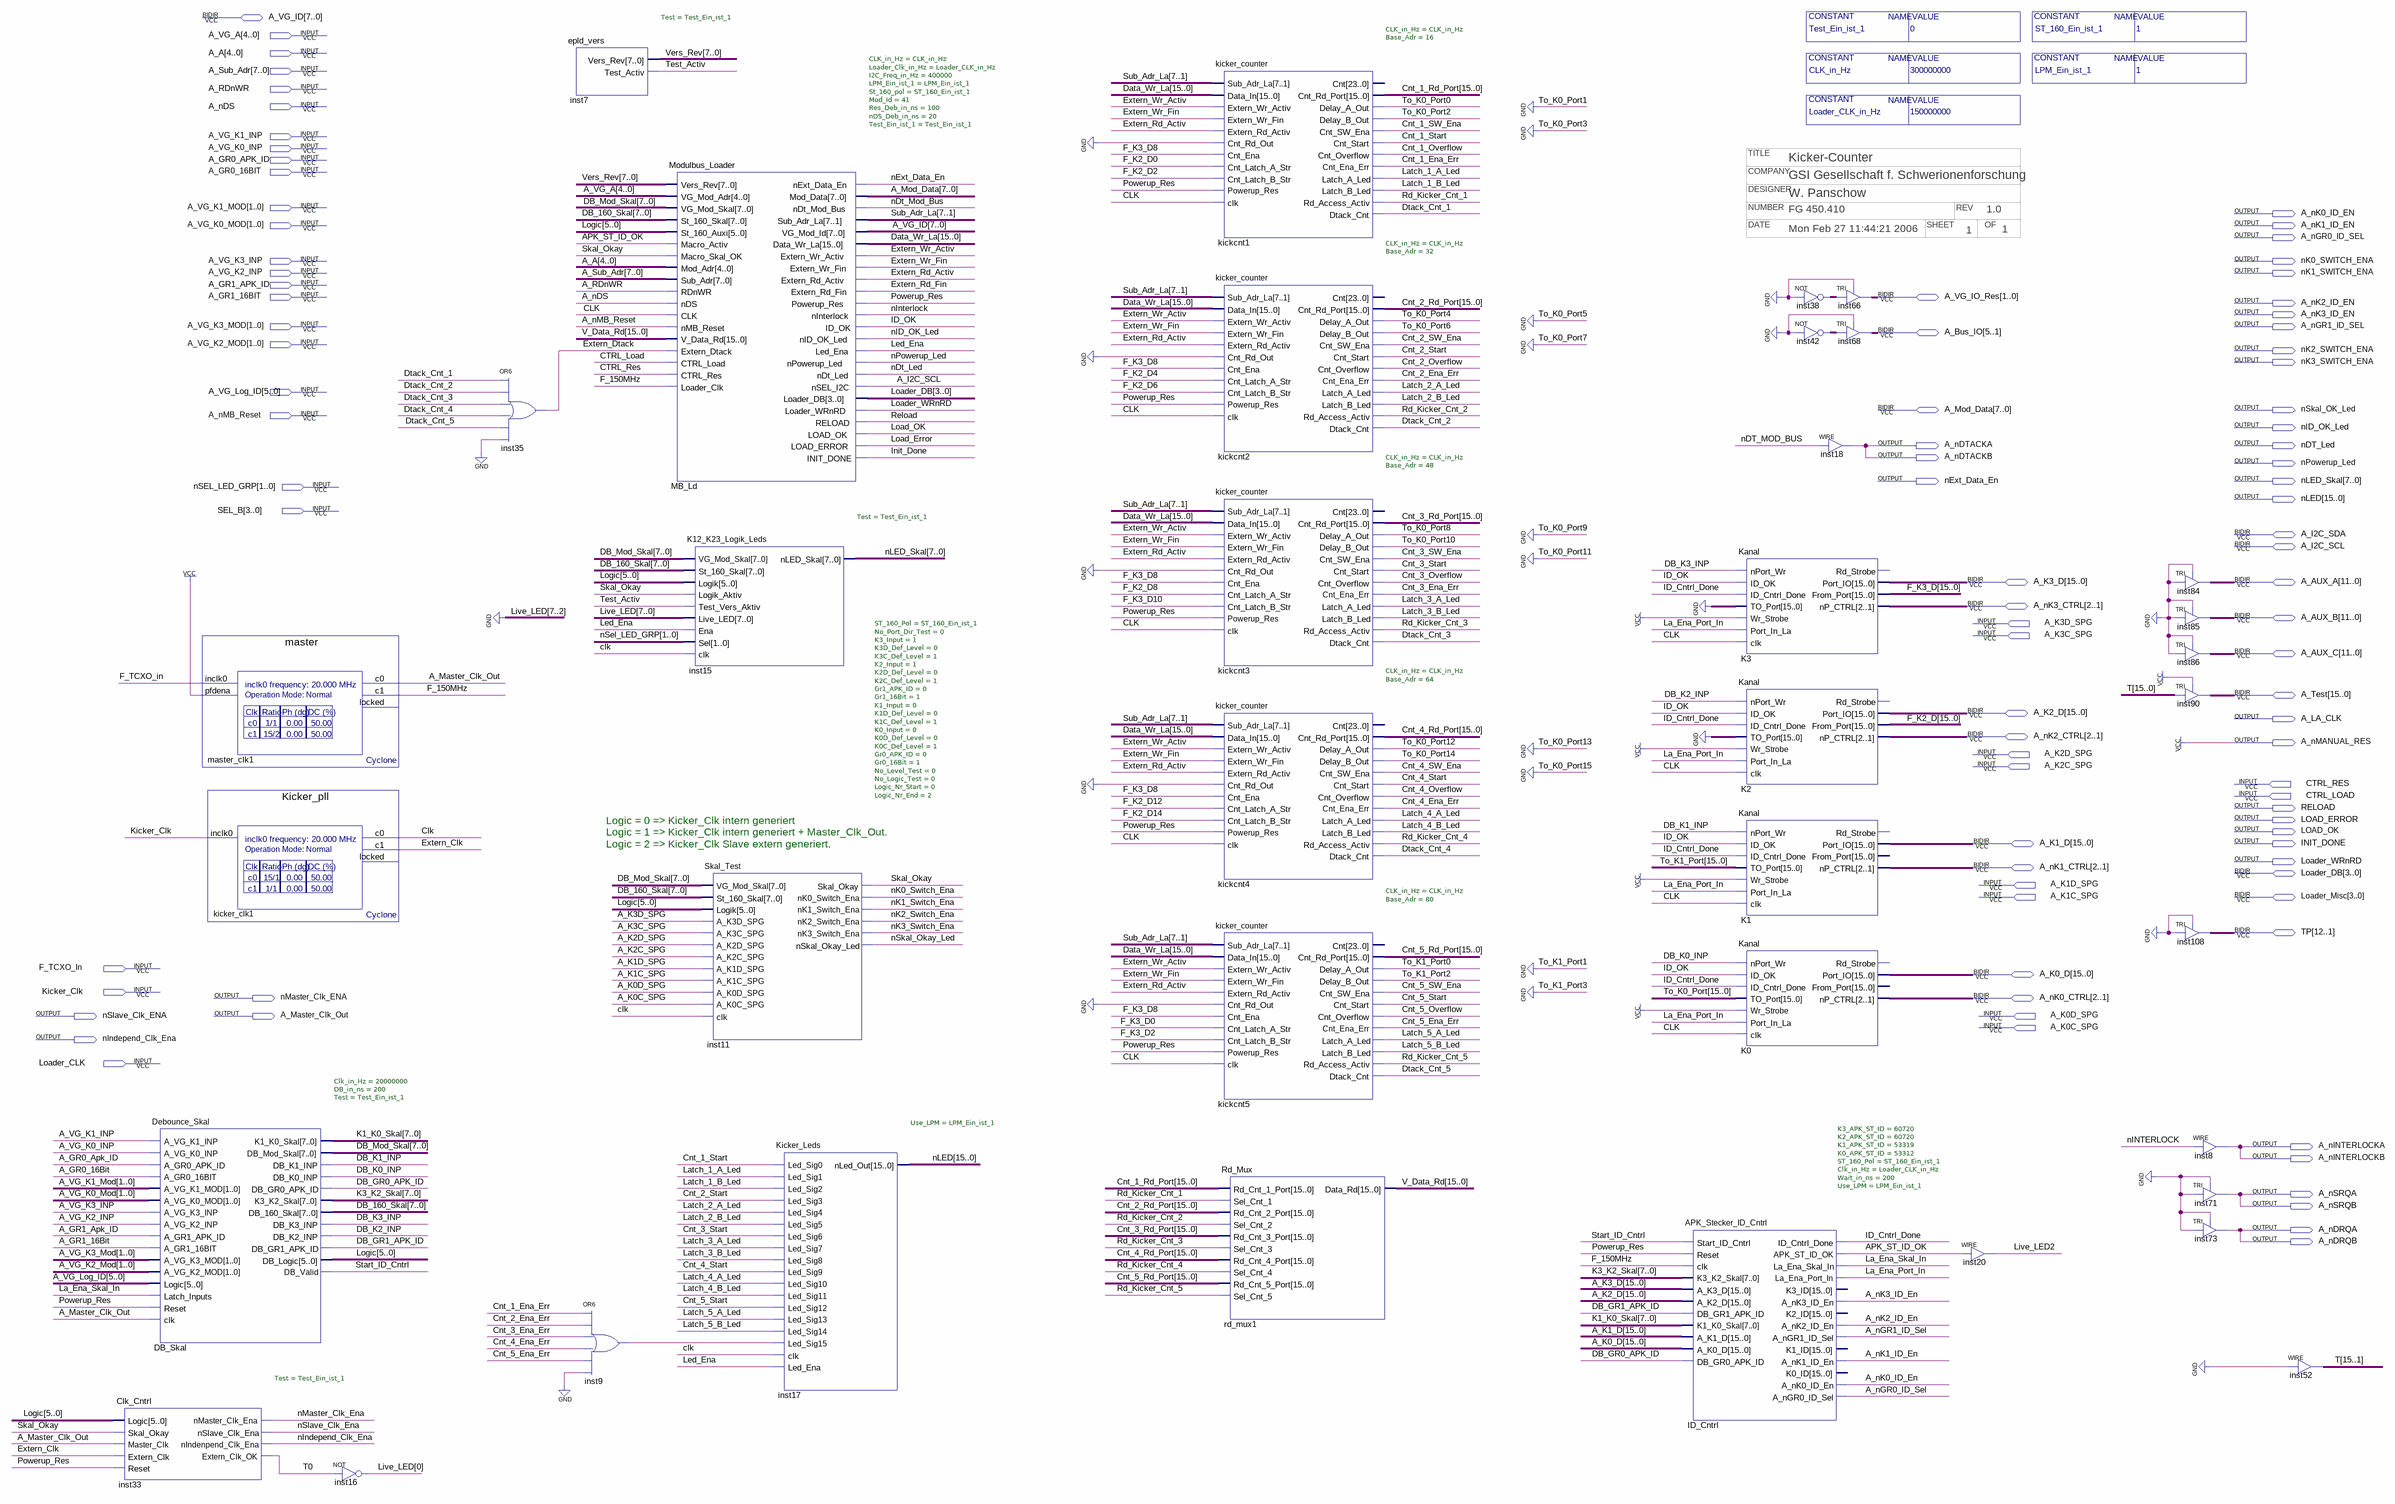
[diagram p0: schematic sheet]
// Quartus schematic Kicker.bdf as structural Verilog: 38 symbols, 91 pins
// Title block: TITLE: Kicker-Counter; COMPANY: GSI Gesellschaft f. Schwerionenforschung; DESIGNER: W. Panschow; NUMBER: FG 450.410; REV: 1.0; DATE: Mon Feb 27 11:44:21 2006; SHEET: 1; OF: 1
module Kicker #(parameter CLK_in_Hz = 300000000, parameter LPM_Ein_ist_1 = 1, parameter ST_160_Ein_ist_1 = 1, parameter Loader_CLK_in_Hz = 150000000, parameter Test_Ein_ist_1 = 0) (
  input  [4:0] A_VG_A,
  input  [4:0] A_A,
  input  [7:0] A_Sub_Adr,
  input  A_RDnWR,
  input  A_nDS,
  input  A_VG_K1_INP,
  input  A_VG_K0_INP,
  input  A_GR0_APK_ID,
  input  A_GR0_16BIT,
  input  [1:0] A_VG_K1_MOD,
  input  [1:0] A_VG_K0_MOD,
  input  A_VG_K3_INP,
  input  A_VG_K2_INP,
  input  A_GR1_APK_ID,
  input  A_GR1_16BIT,
  input  [1:0] A_VG_K3_MOD,
  input  [1:0] A_VG_K2_MOD,
  input  [5:0] A_VG_Log_ID,
  input  A_nMB_Reset,
  input  [1:0] nSEL_LED_GRP,
  input  [3:0] SEL_B,
  input  A_K3D_SPG,
  input  A_K3C_SPG,
  input  A_K2D_SPG,
  input  A_K2C_SPG,
  input  CTRL_RES,
  input  CTRL_LOAD,
  input  A_K1D_SPG,
  input  A_K1C_SPG,
  input  F_TCXO_In,
  input  Kicker_Clk,
  input  A_K0D_SPG,
  input  A_K0C_SPG,
  input  Loader_CLK,
  inout  [7:0] A_VG_ID,
  inout  [1:0] A_VG_IO_Res,
  inout  [5:1] A_Bus_IO,
  inout  [7:0] A_Mod_Data,
  inout  A_I2C_SDA,
  inout  A_I2C_SCL,
  inout  [15:0] A_K3_D,
  inout  [11:0] A_AUX_A,
  inout  [2:1] A_nK3_CTRL,
  inout  [11:0] A_AUX_B,
  inout  [11:0] A_AUX_C,
  inout  [15:0] A_Test,
  inout  [15:0] A_K2_D,
  inout  [2:1] A_nK2_CTRL,
  inout  [15:0] A_K1_D,
  inout  [2:1] A_nK1_CTRL,
  inout  [3:0] Loader_DB,
  inout  [3:0] Loader_Misc,
  inout  [12:1] TP,
  inout  [15:0] A_K0_D,
  inout  [2:1] A_nK0_CTRL,
  output A_nK0_ID_EN,
  output A_nK1_ID_EN,
  output A_nGR0_ID_SEL,
  output nK0_SWITCH_ENA,
  output nK1_SWITCH_ENA,
  output A_nK2_ID_EN,
  output A_nK3_ID_EN,
  output A_nGR1_ID_SEL,
  output nK2_SWITCH_ENA,
  output nK3_SWITCH_ENA,
  output nSkal_OK_Led,
  output nID_OK_Led,
  output A_nDTACKA,
  output nDT_Led,
  output A_nDTACKB,
  output nPowerup_Led,
  output nExt_Data_En,
  output [7:0] nLED_Skal,
  output [15:0] nLED,
  output A_LA_CLK,
  output A_nMANUAL_RES,
  output RELOAD,
  output LOAD_ERROR,
  output LOAD_OK,
  output INIT_DONE,
  output Loader_WRnRD,
  output nMaster_Clk_ENA,
  output nSlave_Clk_ENA,
  output A_Master_Clk_Out,
  output nIndepend_Clk_Ena,
  output A_nINTERLOCKA,
  output A_nINTERLOCKB,
  output A_nSRQA,
  output A_nSRQB,
  output A_nDRQA,
  output A_nDRQB
);

  wire APK_ST_ID_OK, CLK, Cnt_1_Ena_Err, Cnt_1_Overflow, Cnt_1_Start, Cnt_1_SW_Ena, Cnt_2_Ena_Err,
       Cnt_2_Overflow, Cnt_2_Start, Cnt_2_SW_Ena, Cnt_3_Ena_Err, Cnt_3_Overflow, Cnt_3_Start, Cnt_3_SW_Ena,
       Cnt_4_Ena_Err, Cnt_4_Overflow, Cnt_4_Start, Cnt_4_SW_Ena, Cnt_5_Ena_Err, Cnt_5_Overflow, Cnt_5_Start,
       Cnt_5_SW_Ena, DB_GR0_APK_ID, DB_GR1_APK_ID, DB_K0_INP, DB_K1_INP, DB_K2_INP, DB_K3_INP, Dtack_Cnt_1,
       Dtack_Cnt_2, Dtack_Cnt_3, Dtack_Cnt_4, Dtack_Cnt_5, Extern_Clk, Extern_Dtack, Extern_Rd_Activ,
       Extern_Rd_Fin, Extern_Wr_Activ, Extern_Wr_Fin, F_150MHz, ID_Cntrl_Done, ID_OK, inst9_out,
       La_Ena_Port_In, La_Ena_Skal_In, Latch_1_A_Led, Latch_1_B_Led, Latch_2_A_Led, Latch_2_B_Led,
       Latch_3_A_Led, Latch_3_B_Led, Latch_4_A_Led, Latch_4_B_Led, Latch_5_A_Led, Latch_5_B_Led, Led_Ena,
       nDT_MOD_BUS, nInterlock, nSkal_Okay_Led, Powerup_Res, Rd_Kicker_Cnt_1, Rd_Kicker_Cnt_2,
       Rd_Kicker_Cnt_3, Rd_Kicker_Cnt_4, Rd_Kicker_Cnt_5, Skal_Okay, Start_ID_Cntrl, Test_Activ;
  wire [1:0] inst38_out;
  wire [2:0] Live_LED;
  wire [4:0] inst42_out;
  wire [5:0] Logic;
  wire [7:0] DB_160_Skal, DB_Mod_Skal, K1_K0_Skal, K3_K2_Skal, Vers_Rev;
  wire [7:1] Sub_Adr_La;
  wire [14:0] To_K0_Port;
  wire [15:0] Cnt_1_Rd_Port, Cnt_2_Rd_Port, Cnt_3_Rd_Port, Cnt_4_Rd_Port, Cnt_5_Rd_Port, Data_Wr_La, F_K2_D,
       F_K3_D, T, To_K1_Port, V_Data_Rd;

  Debounce_Skal #(.Clk_in_Hz(20000000), .DB_in_ns(200), .Test(Test_Ein_ist_1)) DB_Skal (
    .A_VG_K1_INP(A_VG_K1_INP), .A_VG_K0_INP(A_VG_K0_INP), .A_GR0_APK_ID(A_GR0_APK_ID),
    .A_GR0_16BIT(A_GR0_16BIT), .A_VG_K1_MOD(A_VG_K1_MOD), .A_VG_K0_MOD(A_VG_K0_MOD),
    .A_VG_K3_INP(A_VG_K3_INP), .A_VG_K2_INP(A_VG_K2_INP), .A_GR1_APK_ID(A_GR1_APK_ID),
    .A_GR1_16BIT(A_GR1_16BIT), .A_VG_K3_MOD(A_VG_K3_MOD), .A_VG_K2_MOD(A_VG_K2_MOD), .Logic(A_VG_Log_ID),
    .Latch_Inputs(La_Ena_Skal_In), .Reset(Powerup_Res), .clk(A_Master_Clk_Out), .K1_K0_Skal(K1_K0_Skal),
    .DB_Mod_Skal(DB_Mod_Skal), .DB_K1_INP(DB_K1_INP), .DB_K0_INP(DB_K0_INP), .DB_GR0_APK_ID(DB_GR0_APK_ID),
    .K3_K2_Skal(K3_K2_Skal), .DB_160_Skal(DB_160_Skal), .DB_K3_INP(DB_K3_INP), .DB_K2_INP(DB_K2_INP),
    .DB_GR1_APK_ID(DB_GR1_APK_ID), .DB_Logic(Logic), .DB_Valid(Start_ID_Cntrl));
  Clk_Cntrl #(.Test(Test_Ein_ist_1)) inst33 (
    .Logic(Logic), .Skal_Okay(Skal_Okay), .Master_Clk(A_Master_Clk_Out), .Extern_Clk(Extern_Clk),
    .Reset(Powerup_Res), .nMaster_Clk_Ena(nMaster_Clk_ENA), .nSlave_Clk_Ena(nSlave_Clk_ENA),
    .nIndenpend_Clk_Ena(nIndepend_Clk_Ena), .Extern_Clk_OK(T[0]));
  master master_clk1 (.inclk0(F_TCXO_In), .pfdena(1'b1), .c0(A_Master_Clk_Out), .c1(F_150MHz));  // open: locked
  Kicker_pll kicker_clk1 (.inclk0(Kicker_Clk), .c0(CLK), .c1(Extern_Clk));  // open: locked
  not inst16 (Live_LED[0], T[0]);
  or inst35 (Extern_Dtack, Dtack_Cnt_1, Dtack_Cnt_2, Dtack_Cnt_3, Dtack_Cnt_4, Dtack_Cnt_5, 1'b0);
  epld_vers #(.Test(Test_Ein_ist_1)) inst7 (.Vers_Rev(Vers_Rev), .Test_Activ(Test_Activ));
  or inst9 (inst9_out, Cnt_1_Ena_Err, Cnt_2_Ena_Err, Cnt_3_Ena_Err, Cnt_4_Ena_Err, Cnt_5_Ena_Err, 1'b0);
  Modulbus_Loader #(.CLK_in_Hz(CLK_in_Hz), .Loader_Clk_in_Hz(Loader_CLK_in_Hz), .I2C_Freq_in_Hz(400000), .LPM_Ein_ist_1(LPM_Ein_ist_1), .St_160_pol(ST_160_Ein_ist_1), .Mod_Id(41), .Res_Deb_in_ns(100), .nDS_Deb_in_ns(20), .Test_Ein_ist_1(Test_Ein_ist_1)) MB_Ld (
    .Vers_Rev(Vers_Rev), .VG_Mod_Adr(A_VG_A), .VG_Mod_Skal(DB_Mod_Skal), .St_160_Skal(DB_160_Skal),
    .St_160_Auxi(Logic), .Macro_Activ(APK_ST_ID_OK), .Macro_Skal_OK(Skal_Okay), .Mod_Adr(A_A),
    .Sub_Adr(A_Sub_Adr), .RDnWR(A_RDnWR), .nDS(A_nDS), .CLK(CLK), .nMB_Reset(A_nMB_Reset),
    .V_Data_Rd(V_Data_Rd), .Extern_Dtack(Extern_Dtack), .CTRL_Load(CTRL_LOAD), .CTRL_Res(CTRL_RES),
    .Loader_Clk(F_150MHz), .nExt_Data_En(nExt_Data_En), .nDt_Mod_Bus(nDT_MOD_BUS), .Sub_Adr_La(Sub_Adr_La),
    .Data_Wr_La(Data_Wr_La), .Extern_Wr_Activ(Extern_Wr_Activ), .Extern_Wr_Fin(Extern_Wr_Fin),
    .Extern_Rd_Activ(Extern_Rd_Activ), .Extern_Rd_Fin(Extern_Rd_Fin), .Powerup_Res(Powerup_Res),
    .nInterlock(nInterlock), .ID_OK(ID_OK), .nID_OK_Led(nID_OK_Led), .Led_Ena(Led_Ena),
    .nPowerup_Led(nPowerup_Led), .nDt_Led(nDT_Led), .nSEL_I2C(A_I2C_SCL), .Loader_WRnRD(Loader_WRnRD),
    .RELOAD(RELOAD), .LOAD_OK(LOAD_OK), .LOAD_ERROR(LOAD_ERROR), .INIT_DONE(INIT_DONE),
    .Mod_Data(A_Mod_Data), .VG_Mod_Id(A_VG_ID), .Loader_DB(Loader_DB));
  K12_K23_Logik_Leds #(.Test(Test_Ein_ist_1)) inst15 (
    .VG_Mod_Skal(DB_Mod_Skal), .St_160_Skal(DB_160_Skal), .Logik(Logic), .Logik_Aktiv(Skal_Okay),
    .Test_Vers_Aktiv(Test_Activ), .Live_LED({{5{1'b0}}, Live_LED}), .Ena(Led_Ena), .Sel(nSEL_LED_GRP),
    .clk(CLK), .nLED_Skal(nLED_Skal));
  Skal_Test #(.ST_160_Pol(ST_160_Ein_ist_1), .No_Port_Dir_Test(0), .K3_Input(1), .K3D_Def_Level(0), .K3C_Def_Level(1), .K2_Input(1), .K2D_Def_Level(0), .K2C_Def_Level(1), .Gr1_APK_ID(0), .Gr1_16Bit(1), .K1_Input(0), .K1D_Def_Level(0), .K1C_Def_Level(1), .K0_Input(0), .K0D_Def_Level(0), .K0C_Def_Level(1), .Gr0_APK_ID(0), .Gr0_16Bit(1), .No_Level_Test(0), .No_Logic_Test(0), .Logic_Nr_Start(0), .Logic_Nr_End(2)) inst11 (
    .VG_Mod_Skal(DB_Mod_Skal), .St_160_Skal(DB_160_Skal), .Logik(Logic), .A_K3D_SPG(A_K3D_SPG),
    .A_K3C_SPG(A_K3C_SPG), .A_K2D_SPG(A_K2D_SPG), .A_K2C_SPG(A_K2C_SPG), .A_K1D_SPG(A_K1D_SPG),
    .A_K1C_SPG(A_K1C_SPG), .A_K0D_SPG(A_K0D_SPG), .A_K0C_SPG(A_K0C_SPG), .clk(CLK), .Skal_Okay(Skal_Okay),
    .nK0_Switch_Ena(nK0_SWITCH_ENA), .nK1_Switch_Ena(nK1_SWITCH_ENA), .nK2_Switch_Ena(nK2_SWITCH_ENA),
    .nK3_Switch_Ena(nK3_SWITCH_ENA), .nSkal_Okay_Led(nSkal_Okay_Led));
  Kicker_Leds #(.Use_LPM(LPM_Ein_ist_1)) inst17 (
    .Led_Sig0(Cnt_1_Start), .Led_Sig1(Latch_1_A_Led), .Led_Sig2(Latch_1_B_Led), .Led_Sig3(Cnt_2_Start),
    .Led_Sig4(Latch_2_A_Led), .Led_Sig5(Latch_2_B_Led), .Led_Sig6(Cnt_3_Start), .Led_Sig7(Latch_3_A_Led),
    .Led_Sig8(Latch_3_B_Led), .Led_Sig9(Cnt_4_Start), .Led_Sig10(Latch_4_A_Led), .Led_Sig11(Latch_4_B_Led),
    .Led_Sig12(Cnt_5_Start), .Led_Sig13(Latch_5_A_Led), .Led_Sig14(Latch_5_B_Led), .Led_Sig15(inst9_out),
    .clk(CLK), .Led_Ena(Led_Ena), .nLed_Out(nLED));
  kicker_counter #(.CLK_in_Hz(CLK_in_Hz), .Base_Adr(16)) kickcnt1 (
    .Sub_Adr_La(Sub_Adr_La), .Data_In(Data_Wr_La), .Extern_Wr_Activ(Extern_Wr_Activ),
    .Extern_Wr_Fin(Extern_Wr_Fin), .Extern_Rd_Activ(Extern_Rd_Activ), .Cnt_Rd_Out(1'b0), .Cnt_Ena(F_K3_D[8]),
    .Cnt_Latch_A_Str(F_K2_D[0]), .Cnt_Latch_B_Str(F_K2_D[2]), .Powerup_Res(Powerup_Res), .clk(CLK),
    .Cnt_Rd_Port(Cnt_1_Rd_Port), .Delay_A_Out(To_K0_Port[0]), .Delay_B_Out(To_K0_Port[2]),
    .Cnt_SW_Ena(Cnt_1_SW_Ena), .Cnt_Start(Cnt_1_Start), .Cnt_Overflow(Cnt_1_Overflow),
    .Cnt_Ena_Err(Cnt_1_Ena_Err), .Latch_A_Led(Latch_1_A_Led), .Latch_B_Led(Latch_1_B_Led),
    .Rd_Access_Activ(Rd_Kicker_Cnt_1), .Dtack_Cnt(Dtack_Cnt_1));  // open: Cnt
  kicker_counter #(.CLK_in_Hz(CLK_in_Hz), .Base_Adr(32)) kickcnt2 (
    .Sub_Adr_La(Sub_Adr_La), .Data_In(Data_Wr_La), .Extern_Wr_Activ(Extern_Wr_Activ),
    .Extern_Wr_Fin(Extern_Wr_Fin), .Extern_Rd_Activ(Extern_Rd_Activ), .Cnt_Rd_Out(1'b0), .Cnt_Ena(F_K3_D[8]),
    .Cnt_Latch_A_Str(F_K2_D[4]), .Cnt_Latch_B_Str(F_K2_D[6]), .Powerup_Res(Powerup_Res), .clk(CLK),
    .Cnt_Rd_Port(Cnt_2_Rd_Port), .Delay_A_Out(To_K0_Port[4]), .Delay_B_Out(To_K0_Port[6]),
    .Cnt_SW_Ena(Cnt_2_SW_Ena), .Cnt_Start(Cnt_2_Start), .Cnt_Overflow(Cnt_2_Overflow),
    .Cnt_Ena_Err(Cnt_2_Ena_Err), .Latch_A_Led(Latch_2_A_Led), .Latch_B_Led(Latch_2_B_Led),
    .Rd_Access_Activ(Rd_Kicker_Cnt_2), .Dtack_Cnt(Dtack_Cnt_2));  // open: Cnt
  kicker_counter #(.CLK_in_Hz(CLK_in_Hz), .Base_Adr(48)) kickcnt3 (
    .Sub_Adr_La(Sub_Adr_La), .Data_In(Data_Wr_La), .Extern_Wr_Activ(Extern_Wr_Activ),
    .Extern_Wr_Fin(Extern_Wr_Fin), .Extern_Rd_Activ(Extern_Rd_Activ), .Cnt_Rd_Out(1'b0), .Cnt_Ena(F_K3_D[8]),
    .Cnt_Latch_A_Str(F_K2_D[8]), .Cnt_Latch_B_Str(F_K3_D[10]), .Powerup_Res(Powerup_Res), .clk(CLK),
    .Cnt_Rd_Port(Cnt_3_Rd_Port), .Delay_A_Out(To_K0_Port[8]), .Delay_B_Out(To_K0_Port[10]),
    .Cnt_SW_Ena(Cnt_3_SW_Ena), .Cnt_Start(Cnt_3_Start), .Cnt_Overflow(Cnt_3_Overflow),
    .Cnt_Ena_Err(Cnt_3_Ena_Err), .Latch_A_Led(Latch_3_A_Led), .Latch_B_Led(Latch_3_B_Led),
    .Rd_Access_Activ(Rd_Kicker_Cnt_3), .Dtack_Cnt(Dtack_Cnt_3));  // open: Cnt
  kicker_counter #(.CLK_in_Hz(CLK_in_Hz), .Base_Adr(64)) kickcnt4 (
    .Sub_Adr_La(Sub_Adr_La), .Data_In(Data_Wr_La), .Extern_Wr_Activ(Extern_Wr_Activ),
    .Extern_Wr_Fin(Extern_Wr_Fin), .Extern_Rd_Activ(Extern_Rd_Activ), .Cnt_Rd_Out(1'b0), .Cnt_Ena(F_K3_D[8]),
    .Cnt_Latch_A_Str(F_K2_D[12]), .Cnt_Latch_B_Str(F_K2_D[14]), .Powerup_Res(Powerup_Res), .clk(CLK),
    .Cnt_Rd_Port(Cnt_4_Rd_Port), .Delay_A_Out(To_K0_Port[12]), .Delay_B_Out(To_K0_Port[14]),
    .Cnt_SW_Ena(Cnt_4_SW_Ena), .Cnt_Start(Cnt_4_Start), .Cnt_Overflow(Cnt_4_Overflow),
    .Cnt_Ena_Err(Cnt_4_Ena_Err), .Latch_A_Led(Latch_4_A_Led), .Latch_B_Led(Latch_4_B_Led),
    .Rd_Access_Activ(Rd_Kicker_Cnt_4), .Dtack_Cnt(Dtack_Cnt_4));  // open: Cnt
  kicker_counter #(.CLK_in_Hz(CLK_in_Hz), .Base_Adr(80)) kickcnt5 (
    .Sub_Adr_La(Sub_Adr_La), .Data_In(Data_Wr_La), .Extern_Wr_Activ(Extern_Wr_Activ),
    .Extern_Wr_Fin(Extern_Wr_Fin), .Extern_Rd_Activ(Extern_Rd_Activ), .Cnt_Rd_Out(1'b0), .Cnt_Ena(F_K3_D[8]),
    .Cnt_Latch_A_Str(F_K3_D[0]), .Cnt_Latch_B_Str(F_K3_D[2]), .Powerup_Res(Powerup_Res), .clk(CLK),
    .Cnt_Rd_Port(Cnt_5_Rd_Port), .Delay_A_Out(To_K1_Port[0]), .Delay_B_Out(To_K1_Port[2]),
    .Cnt_SW_Ena(Cnt_5_SW_Ena), .Cnt_Start(Cnt_5_Start), .Cnt_Overflow(Cnt_5_Overflow),
    .Cnt_Ena_Err(Cnt_5_Ena_Err), .Latch_A_Led(Latch_5_A_Led), .Latch_B_Led(Latch_5_B_Led),
    .Rd_Access_Activ(Rd_Kicker_Cnt_5), .Dtack_Cnt(Dtack_Cnt_5));  // open: Cnt
  Rd_Mux rd_mux1 (
    .Rd_Cnt_1_Port(Cnt_1_Rd_Port), .Sel_Cnt_1(Rd_Kicker_Cnt_1), .Rd_Cnt_2_Port(Cnt_2_Rd_Port),
    .Sel_Cnt_2(Rd_Kicker_Cnt_2), .Rd_Cnt_3_Port(Cnt_3_Rd_Port), .Sel_Cnt_3(Rd_Kicker_Cnt_3),
    .Rd_Cnt_4_Port(Cnt_4_Rd_Port), .Sel_Cnt_4(Rd_Kicker_Cnt_4), .Rd_Cnt_5_Port(Cnt_5_Rd_Port),
    .Sel_Cnt_5(Rd_Kicker_Cnt_5), .Data_Rd(V_Data_Rd));
  APK_Stecker_ID_Cntrl #(.K3_APK_ST_ID(60720), .K2_APK_ST_ID(60720), .K1_APK_ST_ID(53319), .K0_APK_ST_ID(53312), .ST_160_Pol(ST_160_Ein_ist_1), .Clk_in_Hz(Loader_CLK_in_Hz), .Wait_in_ns(200), .Use_LPM(LPM_Ein_ist_1)) ID_Cntrl (
    .Start_ID_Cntrl(Start_ID_Cntrl), .Reset(Powerup_Res), .clk(F_150MHz), .K3_K2_Skal(K3_K2_Skal),
    .A_K3_D(A_K3_D), .A_K2_D(A_K2_D), .DB_GR1_APK_ID(DB_GR1_APK_ID), .K1_K0_Skal(K1_K0_Skal),
    .A_K1_D(A_K1_D), .A_K0_D(A_K0_D), .DB_GR0_APK_ID(DB_GR0_APK_ID), .ID_Cntrl_Done(ID_Cntrl_Done),
    .APK_ST_ID_OK(APK_ST_ID_OK), .La_Ena_Skal_In(La_Ena_Skal_In), .La_Ena_Port_In(La_Ena_Port_In),
    .A_nK3_ID_En(A_nK3_ID_EN), .A_nK2_ID_En(A_nK2_ID_EN), .A_nGR1_ID_Sel(A_nGR1_ID_SEL),
    .A_nK1_ID_En(A_nK1_ID_EN), .A_nK0_ID_En(A_nK0_ID_EN), .A_nGR0_ID_Sel(A_nGR0_ID_SEL));  // open: K3_ID, K2_ID, K1_ID, K0_ID
  Kanal K3 (
    .nPort_Wr(DB_K3_INP), .ID_OK(ID_OK), .ID_Cntrl_Done(ID_Cntrl_Done), .TO_Port({16{1'b0}}),
    .Wr_Strobe(1'b1), .Port_In_La(La_Ena_Port_In), .clk(CLK), .From_Port(F_K3_D), .Port_IO(A_K3_D),
    .nP_CTRL(A_nK3_CTRL));  // open: Rd_Strobe
  Kanal K2 (
    .nPort_Wr(DB_K2_INP), .ID_OK(ID_OK), .ID_Cntrl_Done(ID_Cntrl_Done), .TO_Port({16{1'b0}}),
    .Wr_Strobe(1'b1), .Port_In_La(La_Ena_Port_In), .clk(CLK), .From_Port(F_K2_D), .Port_IO(A_K2_D),
    .nP_CTRL(A_nK2_CTRL));  // open: Rd_Strobe
  Kanal K1 (
    .nPort_Wr(DB_K1_INP), .ID_OK(ID_OK), .ID_Cntrl_Done(ID_Cntrl_Done),
    .TO_Port({To_K1_Port[15:4], 1'b0, To_K1_Port[2], 1'b0, To_K1_Port[0]}), .Wr_Strobe(1'b1),
    .Port_In_La(La_Ena_Port_In), .clk(CLK), .Port_IO(A_K1_D), .nP_CTRL(A_nK1_CTRL));  // open: Rd_Strobe, From_Port
  Kanal K0 (
    .nPort_Wr(DB_K0_INP), .ID_OK(ID_OK), .ID_Cntrl_Done(ID_Cntrl_Done),
    .TO_Port({1'b0, To_K0_Port[14], 1'b0, To_K0_Port[12], 1'b0, To_K0_Port[10], 1'b0, To_K0_Port[8], 1'b0, To_K0_Port[6], 1'b0, To_K0_Port[4], 1'b0, To_K0_Port[2], 1'b0, To_K0_Port[0]}),
    .Wr_Strobe(1'b1), .Port_In_La(La_Ena_Port_In), .clk(CLK), .Port_IO(A_K0_D), .nP_CTRL(A_nK0_CTRL));  // open: Rd_Strobe, From_Port
  assign inst38_out = ~2'b00;  // NOT inst38, 2 bits wide
  assign inst42_out = ~{5{1'b0}};  // NOT inst42, 5 bits wide
  assign A_nDTACKA = nDT_MOD_BUS;  // WIRE inst18
  TRI inst66[1:0] (.IN(inst38_out), .OE(1'b0), .OUT(A_VG_IO_Res));
  TRI inst68[4:0] (.IN(inst42_out), .OE(1'b0), .OUT(A_Bus_IO));
  assign Live_LED[2] = APK_ST_ID_OK;  // WIRE inst20
  TRI inst84[11:0] (.IN(1'b0), .OE(1'b0), .OUT(A_AUX_A));
  TRI inst85[11:0] (.IN(1'b0), .OE(1'b0), .OUT(A_AUX_B));
  TRI inst86[11:0] (.IN(1'b0), .OE(1'b0), .OUT(A_AUX_C));
  TRI inst90[15:0] (.IN(T), .OE(1'b1), .OUT(A_Test));
  TRI inst108[11:0] (.IN(1'b0), .OE(1'b0), .OUT(TP));
  assign A_nINTERLOCKA = nInterlock;  // WIRE inst8
  TRI inst71 (.IN(1'b0), .OE(1'b0), .OUT(A_nSRQA));
  TRI inst73 (.IN(1'b0), .OE(1'b0), .OUT(A_nDRQA));
  assign T[15:1] = {15{1'b0}};  // WIRE inst52

  assign A_nDRQB = A_nDRQA;
  assign A_nDTACKB = A_nDTACKA;
  assign A_nINTERLOCKB = A_nINTERLOCKA;
  assign A_nMANUAL_RES = 1'b1;
  assign A_nSRQB = A_nSRQA;
  // also tied to GND on the sheet: Live_LED[2]

  // Notes on the sheet:
  //   Logic = 0 => Kicker_Clk intern generiert
  //   Logic = 1 => Kicker_Clk intern generiert + Master_Clk_Out.
  //   Logic = 2 => Kicker_Clk Slave extern generiert.
endmodule
